# Altium project AirScout2.0.PrjPcb
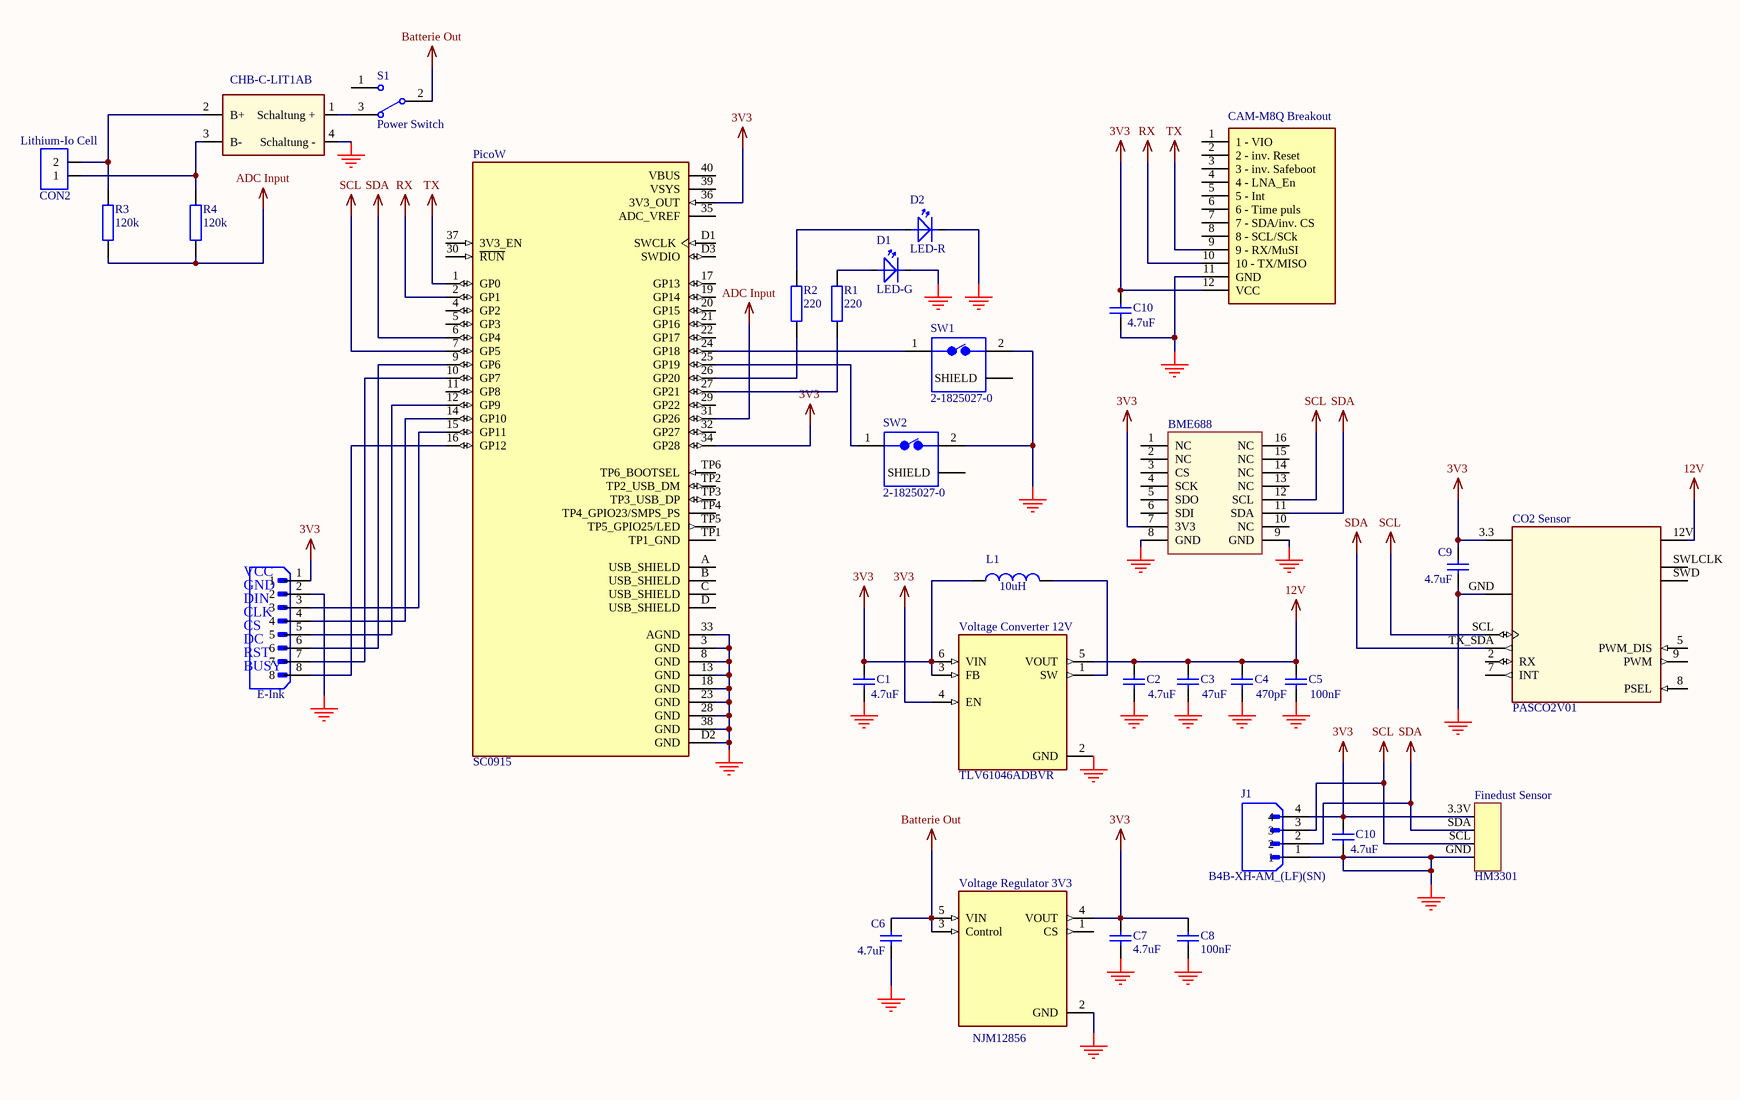
[diagram p0: Sheet1.SchDoc]
1 sheet, 32 parts. Net scope: global (net labels, ports and power ports of the same name join across sheets).
Board files: PCB1.PcbDoc, PCB2.PcbDoc

## Sheet Sheet1.SchDoc
size A0; SheetNumber: 1; SheetTotal: 1

### Parts
(Parts that share a designator on the sheet are numbered #1, #2 ... from top to bottom, then left to right.)
BME688  (no value)  [MIKROE-4893]
C1  value 4.7uF  [C1206]  (hidden comment: Cap)
C2  value 4.7uF  [C1206]  (hidden comment: Cap)
C3  value 47uF  [C1206]  (hidden comment: Cap)
C4  value 470pF  [C1206]  (hidden comment: Cap)
C5  value 100nF  [C1206]  (hidden comment: Cap)
C6  value 4.7uF  [C1206]  (hidden comment: Cap)
C7  value 4.7uF  [C1206]  (hidden comment: Cap)
C8  value 100nF  [C1206]  (hidden comment: Cap)
C9  value 4.7uF  [C1206]  (hidden comment: Cap)
C10#1  value 4.7uF  [C1206]  (hidden comment: Cap)
C10#2  value 4.7uF  [C1206]  (hidden comment: Cap)
CHB-C-LIT1A  Name  [DEBO1 3.7LI 1.0A Entwicklerboards]  (value not drawn)  (part B of 2)
CO2_Sensor  PASCO2V01  [IFX-SMD-LG-MLGA-14-1-V_MODUL]
D1  LED-G  [LED-1]
D2  LED-R  [LED-1]
Finedust_Sensor  HM3301  [HM3301]
GPS_Modul  CAM-M8Q Breakout  [CAM-M8Q-Breakout]
J1  B4B-XH-AM_(LF)(SN)  [JST_B4B-XH-AM_(LF)(SN)]
L1  value 10uH  [IHLP3232DZER330M11]  (hidden comment: Inductor)
Lithium-Io_Cell  CON2  [KL-2]
PicoW  SC0915  [MODULE_SC0915]
R1  value 220  [C1206]  (hidden comment: RES)
R2  value 220  [C1206]  (hidden comment: RES)
R3  120k  [C1206]
R4  120k  [C1206]
S1  Power Switch  [TL36WW15050]
SW1  2-1825027-0  [TE_2-1825027-0]
SW2  2-1825027-0  [TE_2-1825027-0]
Voltage_Converter_12V  TLV61046ADBVR  [SOT95P280X145-6N]
Voltage_Regulator_3V3  NJM12856  [SOT89-5]
  E-Ink  [e-paper]

### Nets
3V3: BME688.7(3V3) C1.2 C7.2 C8.2 C9.2 C10#1.2 C10#2.2 CO2_Sensor.3.3 Finedust_Sensor.3.3V GPS_Modul.12(VCC) J1.4 L1.1 PicoW.34(GP28) PicoW.36(3V3_OUT) Voltage_Converter_12V.3(FB) Voltage_Converter_12V.4(EN) Voltage_Converter_12V.6(VIN) Voltage_Regulator_3V3.4(VOUT) .1
12V: C2.2 C3.2 C4.2 C5.2 CO2_Sensor.12V Voltage_Converter_12V.5(VOUT)
ADC Input: PicoW.31(GP26) R3.1 R4.2
Batterie Out: C6.2 S1.2 Voltage_Regulator_3V3.3(Control) Voltage_Regulator_3V3.5(VIN)
GND: BME688.8(GND) BME688.9(GND) C1.1 C2.1 C3.1 C4.1 C5.1 C6.1 C7.1 C8.1 C9.1 C10#1.1 C10#2.1 CHB-C-LIT1A.4(Schaltung_-) CO2_Sensor.GND D1.2(K) D2.2(K) Finedust_Sensor.GND GPS_Modul.11(GND) J1.1 PicoW.3(GND) PicoW.8(GND) PicoW.13(GND) PicoW.18(GND) PicoW.23(GND) PicoW.28(GND) PicoW.33(AGND) PicoW.38(GND) PicoW.D2(GND) SW1.2 SW2.2 Voltage_Converter_12V.2(GND) Voltage_Regulator_3V3.2(GND) .2
RX: GPS_Modul.10(10_-_TX/MISO) PicoW.2(GP1)
SCL: BME688.12(SCL) CO2_Sensor.SCL Finedust_Sensor.SCL J1.3 PicoW.7(GP5)
SDA: BME688.11(SDA) CO2_Sensor.TX_SDA Finedust_Sensor.SDA J1.2 PicoW.6(GP4)
TX: GPS_Modul.9(9_-_RX/MuSI) PicoW.1(GP0)
NetCHB-C-LIT1A_1: CHB-C-LIT1A.1(Schaltung_+) S1.3
NetCHB-C-LIT1A_2: CHB-C-LIT1A.2(B+) Lithium-Io_Cell.2 R3.2
NetCHB-C-LIT1A_3: CHB-C-LIT1A.3(B-) Lithium-Io_Cell.1 R4.1
NetD1_1: D1.1(A) R1.1
NetD2_1: D2.1(A) R2.1
NetL1_2: L1.2 Voltage_Converter_12V.1(SW)
NetPicoW_9: PicoW.9(GP6) .6
NetPicoW_10: PicoW.10(GP7) .7
NetPicoW_12: PicoW.12(GP9) .5
NetPicoW_14: PicoW.14(GP10) .4
NetPicoW_15: PicoW.15(GP11) .3
NetPicoW_16: PicoW.16(GP12) .8
NetPicoW_24: PicoW.24(GP18) SW1.1
NetPicoW_25: PicoW.25(GP19) SW2.1
NetPicoW_26: PicoW.26(GP20) R2.2
NetPicoW_27: PicoW.27(GP21) R1.2
NetSW1_S1: SW1.S1(SHIELD) SW1.S2(SHIELD)
NetSW2_S1: SW2.S1(SHIELD) SW2.S2(SHIELD)

Not connected (* = marked no-connect by the designer): BME688 1(NC) 2(NC) 3(CS) 4(SCK) 5(SDO) 6(SDI) 10(NC) 13(NC) 14(NC) 15(NC) 16(NC); CO2_Sensor 2(RX) 5(PWM_DIS) 7(INT) 8(PSEL) 9(PWM) SWD SWLCLK; GPS_Modul 1(1_-_VIO) 2(2_-_inv._Reset) 3(3_-_inv._Safeboot) 4(4_-_LNA_En) 5(5_-_Int) 6(6_-_Time_puls) 7(7_-_SDA/inv._CS) 8(8_-_SCL/SCk); PicoW 4(GP2) 5(GP3) 11(GP8) 17(GP13) 19(GP14) 20(GP15) 21(GP16) 22(GP17) 29(GP22) 30(~{RUN}) 32(GP27) 35(ADC_VREF) 37(3V3_EN) 39(VSYS) 40(VBUS) A(USB_SHIELD) B(USB_SHIELD) C(USB_SHIELD) D(USB_SHIELD) D1(SWCLK) D3(SWDIO) TP1(TP1_GND) TP2(TP2_USB_DM) TP3(TP3_USB_DP) TP4(TP4_GPIO23/SMPS_PS) TP5(TP5_GPIO25/LED) TP6(TP6_BOOTSEL); S1 1; Voltage_Regulator_3V3 1(CS)

### Notes on the sheet
- (in symbol B8B-XH-A(LF)(SN)) VCC; GND; DIN; CLK; CS; DC; RST; BUSY

### Library data of the parts
BME688 = MIKROE-4893 - 3V3
C1-C9 C10#1 C10#2 = Cap: Capacitor; Published: 8-Jun-2000; LatestRevisionDate: 17-Jul-2002; LatestRevisionNote: Re-released for DXP Platform.; PackageReference: RAD-0.3; Publisher: Altium Limited; PackageDescription: Radial Cap, Thru-Hole; 2 Leads; 0.3 in Pin Spacing
CO2_Sensor = PASCO2V01: XENSIV PAS CO2; Manufacturer: Infineon Technologies; PackageReference: LG-MLGA-14-1; Manufacturer Order Number: PASCO2V01
D1 D2 = LED: Diode
Finedust_Sensor = Component_1
GPS_Modul = DT15-12PA: DT Series 12 Position Dual Row 4.44 mm Panel Mount Receptacle; MF: TE Connectivity; Value: *; Package: None; Availability: Unavailable; SnapEDA_Link: https://www.snapeda.com/parts/DT15-12PA/TE%20Connectivity%20Deutsch%20Connectors/view-part/2279777/?ref=snap; MP: DT15-12PA; Price: None
J1 = B4B-XH-AM_(LF)(SN): Conn Shrouded Header HDR 4 POS 2.5mm Solder ST Top Entry Thru-Hole Box; MF: JST Corporation; MP: B4B-XH-AM (LF)(SN); Package: None; Price: None; Check_prices: https://www.snapeda.com/parts/B4B-XH-AM%20(LF)(SN)/JST/view-part/?ref=eda; Value: *; SnapEDA_Link: https://www.snapeda.com/parts/B4B-XH-AM%20(LF)(SN)/JST/view-part/?ref=snap; Availability: In Stock; Purchase-URL: https://pricing.snapeda.com/search?q=B4B-XH-AM (LF)(SN)&ref=eda
L1 = Inductor: Code_IEC: 1005; Published: 8-Jun-2000; LatestRevisionDate: 29-May-2009; LatestRevisionNote: IPC-7351 Footprint Added.; PackageReference: 0402-A; Publisher: Altium Limited; PackageDescription: Chip Inductor; Code_JEITA: 0402
Lithium-Io_Cell = CON2: Stecker
PicoW = SC0915: RP2040 Raspberry Pi Pico series ARMÂ® CortexÂ®-M0+ MCU 32-Bit Embedded Evaluation Board; SnapEDA_Link: https://www.snapeda.com/parts/SC0915/Raspberry+Pi/view-part/?ref=snap; Availability: In Stock; Package: None; Price: None; MP: SC0915; Check_prices: https://www.snapeda.com/parts/SC0915/Raspberry+Pi/view-part/?ref=eda; MF: Raspberry Pi; Value: *; Purchase-URL: https://pricing.snapeda.com/search/part/SC0915/?ref=eda
R1-R4 = RES: Widerstand
S1 = SW-SPDT: SPDT Subminiature Toggle Switch, Right Angle Mounting, Vertical Actuation; Published: 24-Mar-1999; LatestRevisionDate: 17-Dec-2003; LatestRevisionNote: Schematic revised, PCB Footprint replaced.; DatasheetVersion: 05-Dec-2000; PackageReference: TL36WW15050; Publisher: Altium Limited; PackageDescription: Switch; 4 Leads; ComponentLink1Description: Manufacturer Link; ComponentLink1URL: http://www.apem.com
SW1 SW2 = 2-1825027-0: Switch Tactile OFF _ON_ SPST Round Button PC Pins 0.05A 24VDC 1.57N Thru-Hole Loose Piece; MF: TE Connectivity; TE_purchase_URL: https://www.te.com/usa-en/product-2-1825027-0.html?te_bu=Cor&te_type=disp&te_campaign=seda_glo_cor-seda-global-disp-prtnr-fy19-seda-model-bom-cta_sma-317_1&elqCampaignId=32493; SnapEDA_Link: https://www.snapeda.com/parts/2-1825027-0/TE%20Connectivity%20ALCOSWITCH%20Switches/view-part/236241/?ref=snap; Package: None; MP: 2-1825027-0; Value: *; EU_RoHS_Compliance: Compliant; Availability: Unavailable; Price: None
Voltage_Converter_12V Voltage_Regulator_3V3 = TLV61046ADBVR: Boost Switching Regulator IC Positive Adjustable 3.3V 1 Output SOT-23-6; MF: Texas Instruments; Package: SOT-23 Texas Instruments; Value: *; Digi-Key_Purchase_URL: https://www.digikey.com/product-detail/en/texas-instruments/TLV61046ADBVR/296-47674-1-ND/8133043?utm_source=snapeda&utm_medium=aggregator&utm_campaign=symbol; Digi-Key_Part_Number: 296-47674-1-ND; SnapEDA_Link: https://www.snapeda.com/parts/TLV61046ADBVR/Texas%20Instruments/view-part/985721/?ref=snap; MP: TLV61046ADBVR
 = B8B-XH-A(LF)(SN): Connector Header Through Hole 8 position 0.098 (2.50mm); MF: JST Sales America Inc.